# EAGLE schematic B01_IchigojamCap-Y_v1.0 (EAGLE 9.0.0)
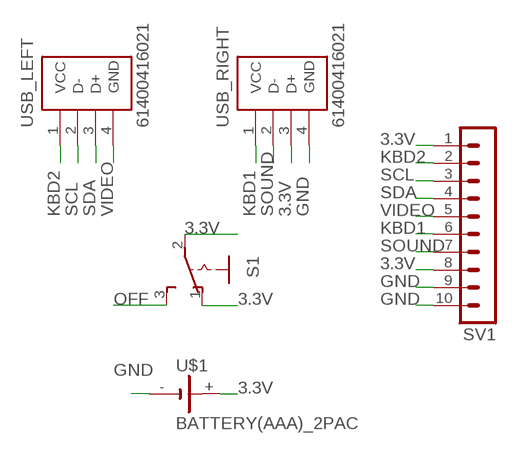
[diagram p0: schematic, sheet 1]

## Parts
S1  255SB  [255SB]
SV1  MA10-1  [MA10-1]
U$1  BATTERY(AAA)_2PAC  [BATTERY_HOLDER]
USB_LEFT  61400416021  [61400416021]
USB_RIGHT  61400416021  [61400416021]

## Nets
3.3V: S1.1(O) S1.2(P) SV1.1 SV1.8 U$1.+ USB_RIGHT.3(D+)
GND: SV1.9 SV1.10 U$1.- USB_RIGHT.4(GND)
KBD1: SV1.6 USB_RIGHT.1(VCC)
KBD2: SV1.2 USB_LEFT.1(VCC)
OFF: S1.3(S)
SCL: SV1.3 USB_LEFT.2(D-)
SDA: SV1.4 USB_LEFT.3(D+)
SOUND: SV1.7 USB_RIGHT.2(D-)
VIDEO: SV1.5 USB_LEFT.4(GND)

## Library data of the parts
S1 = switch:255SB: SLIDING SWITCH Distributor Buerklin, 11G810
SV1 = con-lstb:MA10-1: PIN HEADER; OC_FARNELL: unknown; OC_NEWARK: unknown
U$1 = Y_Library:BATTERY(AAA)_2PAC
USB_LEFT USB_RIGHT = USB_Wuerth_Elektronik_eiCan_Communication_Connectors_STENCIL:61400416021: WR-COM Horizontal USB Type A